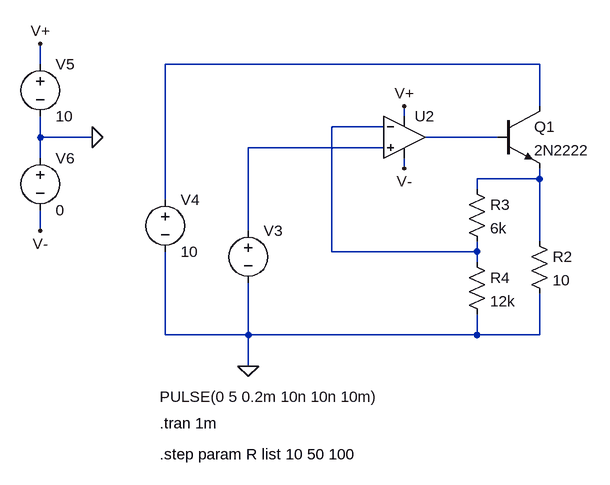
[diagram p0: schematic prof_14_seriese_regurator_opamp.asc]
prof_14_seriese_regurator_opamp.asc, the LTspice schematic file:
Version 4
SHEET 1 2416 3032
WIRE 576 2416 576 2384
WIRE 1344 2416 768 2416
WIRE 1344 2480 1344 2416
WIRE 1136 2496 1136 2480
WIRE 1104 2512 1024 2512
WIRE 576 2528 576 2496
WIRE 656 2528 576 2528
WIRE 1280 2528 1168 2528
WIRE 1104 2544 896 2544
WIRE 576 2560 576 2528
WIRE 1136 2576 1136 2560
WIRE 1344 2592 1344 2576
WIRE 1344 2592 1248 2592
WIRE 1248 2608 1248 2592
WIRE 768 2624 768 2416
WIRE 576 2672 576 2640
WIRE 896 2672 896 2544
WIRE 1344 2688 1344 2592
WIRE 1024 2704 1024 2512
WIRE 1248 2704 1248 2688
WIRE 1248 2704 1024 2704
WIRE 1248 2720 1248 2704
WIRE 768 2832 768 2704
WIRE 896 2832 896 2752
WIRE 896 2832 768 2832
WIRE 1248 2832 1248 2800
WIRE 1248 2832 896 2832
WIRE 1344 2832 1344 2768
WIRE 1344 2832 1248 2832
WIRE 896 2880 896 2832
FLAG 896 2880 0
FLAG 656 2528 0
FLAG 576 2384 V+
FLAG 576 2672 V-
FLAG 1136 2480 V+
FLAG 1136 2576 V-
SYMBOL voltage 896 2656 R0
WINDOW 3 -136 271 Left 2
SYMATTR Value PULSE(0 5 0.2m 10n 10n 10m)
SYMATTR InstName V3
SYMBOL voltage 768 2608 R0
SYMATTR InstName V4
SYMATTR Value 10
SYMBOL res 1232 2592 R0
SYMATTR InstName R3
SYMATTR Value 6k
SYMBOL res 1232 2704 R0
SYMATTR InstName R4
SYMATTR Value 12k
SYMBOL OpAmps/UniversalOpamp2 1136 2528 R0
SYMATTR InstName U2
SYMBOL voltage 576 2400 R0
SYMATTR InstName V5
SYMATTR Value 10
SYMBOL voltage 576 2544 R0
SYMATTR InstName V6
SYMATTR Value 0
SYMBOL npn 1280 2480 R0
SYMATTR InstName Q1
SYMATTR Value 2N2222
SYMBOL res 1328 2672 R0
SYMATTR InstName R2
SYMATTR Value 10
TEXT 760 2968 Left 2 !.tran 1m
TEXT 760 3016 Left 2 !.step param R list 10 50 100

The netlist it stands for:
* prof_14_seriese_regurator_opamp.asc
V3 N004 0 PULSE(0 5 0.2m 10n 10n 10m)
V4 N001 0 10
R3 N005 N002 6k
R4 N002 0 12k
XU2 N004 N002 V+ V- N003 level.2 Avol=1Meg GBW=10Meg Slew=10Meg ilimit=25m rail=0 Vos=0 phimargin=45 en=0 enk=0 in=0 ink=0 Rin=500Meg  ; pins IN+ IN- V+ V- OUT
V5 V+ 0 10
V6 0 V- 0
Q1 N001 N003 N005 0 2N2222
R2 N005 0 10
.model NPN NPN
.model PNP PNP
.lib standard.bjt
.tran 1m
.step param R list 10 50 100
.lib UniversalOpamps2.sub
.backanno
.end